# EAGLE design FTS V1.0 (EAGLE 7.5.0)
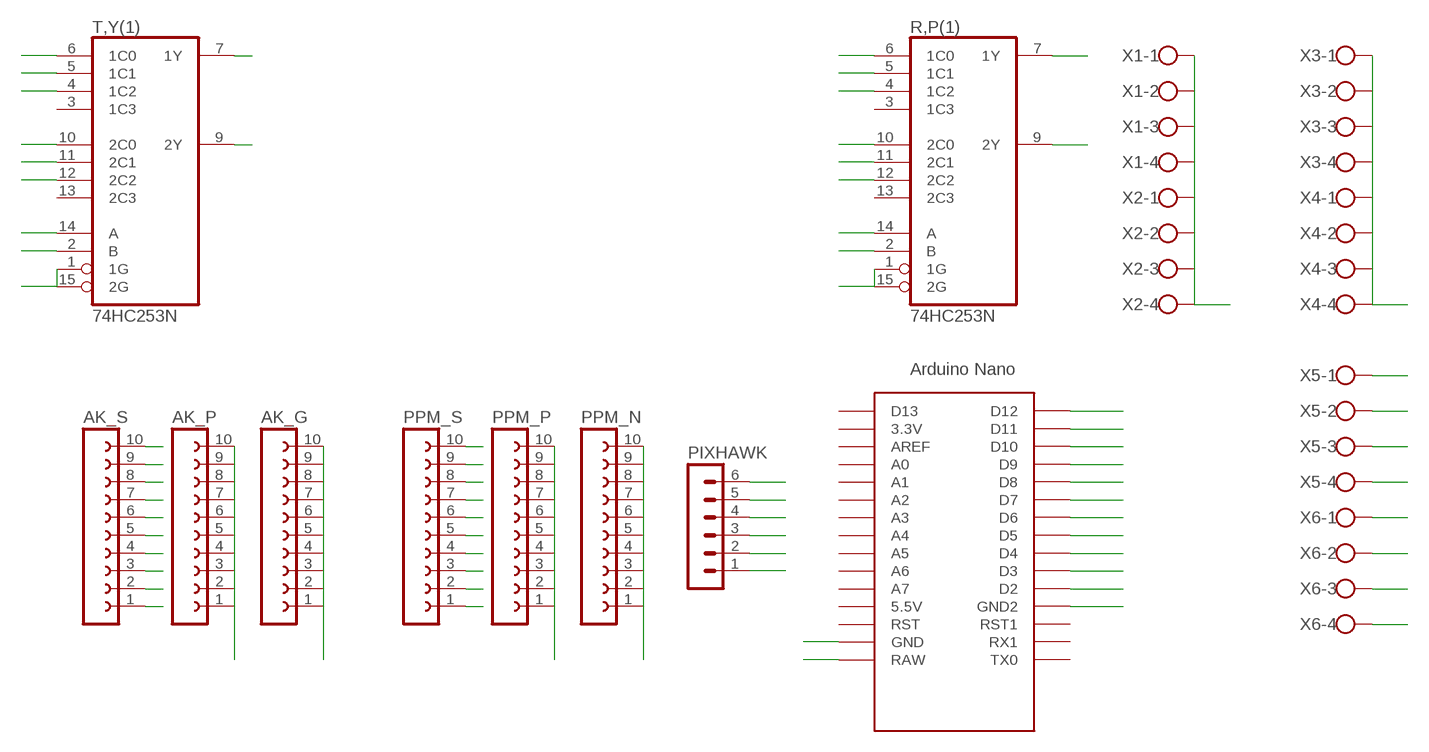
[diagram p0: schematic, sheet 1]

## Parts
AK_G  FE10-1  [FE10]
AK_P  FE10-1  [FE10]
AK_S  FE10-1  [FE10]
PIXHAWK  MA06-1  [MA06-1]
PPM_N  FE10-1  [FE10]
PPM_P  FE10-1  [FE10]
PPM_S  FE10-1  [FE10]
R,P(1)  74HC253N  [DIL16]
T,Y(1)  74HC253N  [DIL16]
U$1  NANO  [NANO]
X1  W237-4  [W237-4]
X2  W237-4  [W237-4]
X3  W237-4  [W237-4]
X4  W237-4  [W237-4]
X5  W237-4  [W237-4]
X6  W237-4  [W237-4]

## Nets
AUX2: AK_S.7 U$1.D6
DROP: AK_S.10 X6.4
FTS-P: R,P(1).12(2C2)
FTS-R: R,P(1).4(1C2)
FTS-T: T,Y(1).4(1C2)
FTS-Y: T,Y(1).12(2C2)
GBL-P: AK_S.9 X6.3
GBL-R: AK_S.8 X6.2
GEAR: AK_S.6 U$1.D5
GND: AK_G.1 AK_G.2 AK_G.3 AK_G.4 AK_G.5 AK_G.6 AK_G.7 AK_G.8 AK_G.9 AK_G.10 PIXHAWK.6 PPM_N.1 PPM_N.2 PPM_N.3 PPM_N.4 PPM_N.5 PPM_N.6 PPM_N.7 PPM_N.8 PPM_N.9 PPM_N.10 R,P(1).1(1G) R,P(1).15(2G) T,Y(1).1(1G) T,Y(1).15(2G) U$1.GND U$1.GND1(GND2) X3.1 X3.2 X3.3 X3.4 X4.1 X4.2 X4.3 X4.4
N$50: PPM_S.10
N$51: PPM_S.9
N$52: PPM_S.8
N$53: PPM_S.7
N$54: PPM_S.6
N$59: PIXHAWK.5
N$71: U$1.D11
N$72: U$1.D10
N$73: U$1.D9
N$74: U$1.D8
N$75: U$1.D7
N$78: U$1.D4
PX-P: PIXHAWK.2 R,P(1).11(2C1)
PX-R: PIXHAWK.1 R,P(1).5(1C1)
PX-T: PIXHAWK.3 T,Y(1).5(1C1)
PX-Y: PIXHAWK.4 T,Y(1).11(2C1)
RX-FM: AK_S.5 PPM_S.5
RX-P: AK_S.2 PPM_S.2 R,P(1).10(2C0)
RX-R: AK_S.1 PPM_S.1 R,P(1).6(1C0)
RX-T: AK_S.3 PPM_S.3 T,Y(1).6(1C0) U$1.D12
RX-Y: AK_S.4 PPM_S.4 T,Y(1).10(2C0)
S1: R,P(1).14(A) T,Y(1).14(A) U$1.D2
S2: R,P(1).2(B) T,Y(1).2(B) U$1.D3
S-P: R,P(1).9(2Y) X5.2
S-R: R,P(1).7(1Y) X5.1
S-T: T,Y(1).7(1Y) X5.3
S-Y: T,Y(1).9(2Y) X5.4 X6.1
VCC: AK_P.1 AK_P.2 AK_P.3 AK_P.4 AK_P.5 AK_P.6 AK_P.7 AK_P.8 AK_P.9 AK_P.10 PPM_P.1 PPM_P.2 PPM_P.3 PPM_P.4 PPM_P.5 PPM_P.6 PPM_P.7 PPM_P.8 PPM_P.9 PPM_P.10 U$1.RAW X1.1 X1.2 X1.3 X1.4 X2.1 X2.2 X2.3 X2.4
Unconnected: R,P(1).3(1C3) R,P(1).13(2C3) T,Y(1).3(1C3) T,Y(1).13(2C3) U$1.3.3V U$1.5V(5.5V) U$1.A0 U$1.A1 U$1.A2 U$1.A3 U$1.A4 U$1.A5 U$1.A6 U$1.A7 U$1.AREF U$1.D13 U$1.ICSP1 U$1.ICSP2 U$1.ICSP3 U$1.ICSP4 U$1.ICSP5 U$1.ICSP6 U$1.RST U$1.RST1 U$1.RX1 U$1.TX0

## Power pins joined to a net without a drawn wire
GND: R,P(1).8(GND) T,Y(1).8(GND)
VCC: R,P(1).16(VCC) T,Y(1).16(VCC)

## Library data of the parts
AK_G AK_P AK_S PPM_N PPM_P PPM_S = con-lsta:FE10-1: FEMALE HEADER; OC_FARNELL: unknown; OC_NEWARK: unknown
PIXHAWK = con-lstb:MA06-1: PIN HEADER; OC_FARNELL: unknown; OC_NEWARK: unknown
R,P(1) T,Y(1) = 74xx-eu:74*253: Dual 4-to 1 line data SELECTOR/MULTIPLEXER, 3-state
U$1 = Arduino-clone:NANO: Arduino Nano
X1-X6 = con-wago-500:W237-4: WAGO SCREW CLAMP; OC_FARNELL: unknown; OC_NEWARK: unknown

## Board
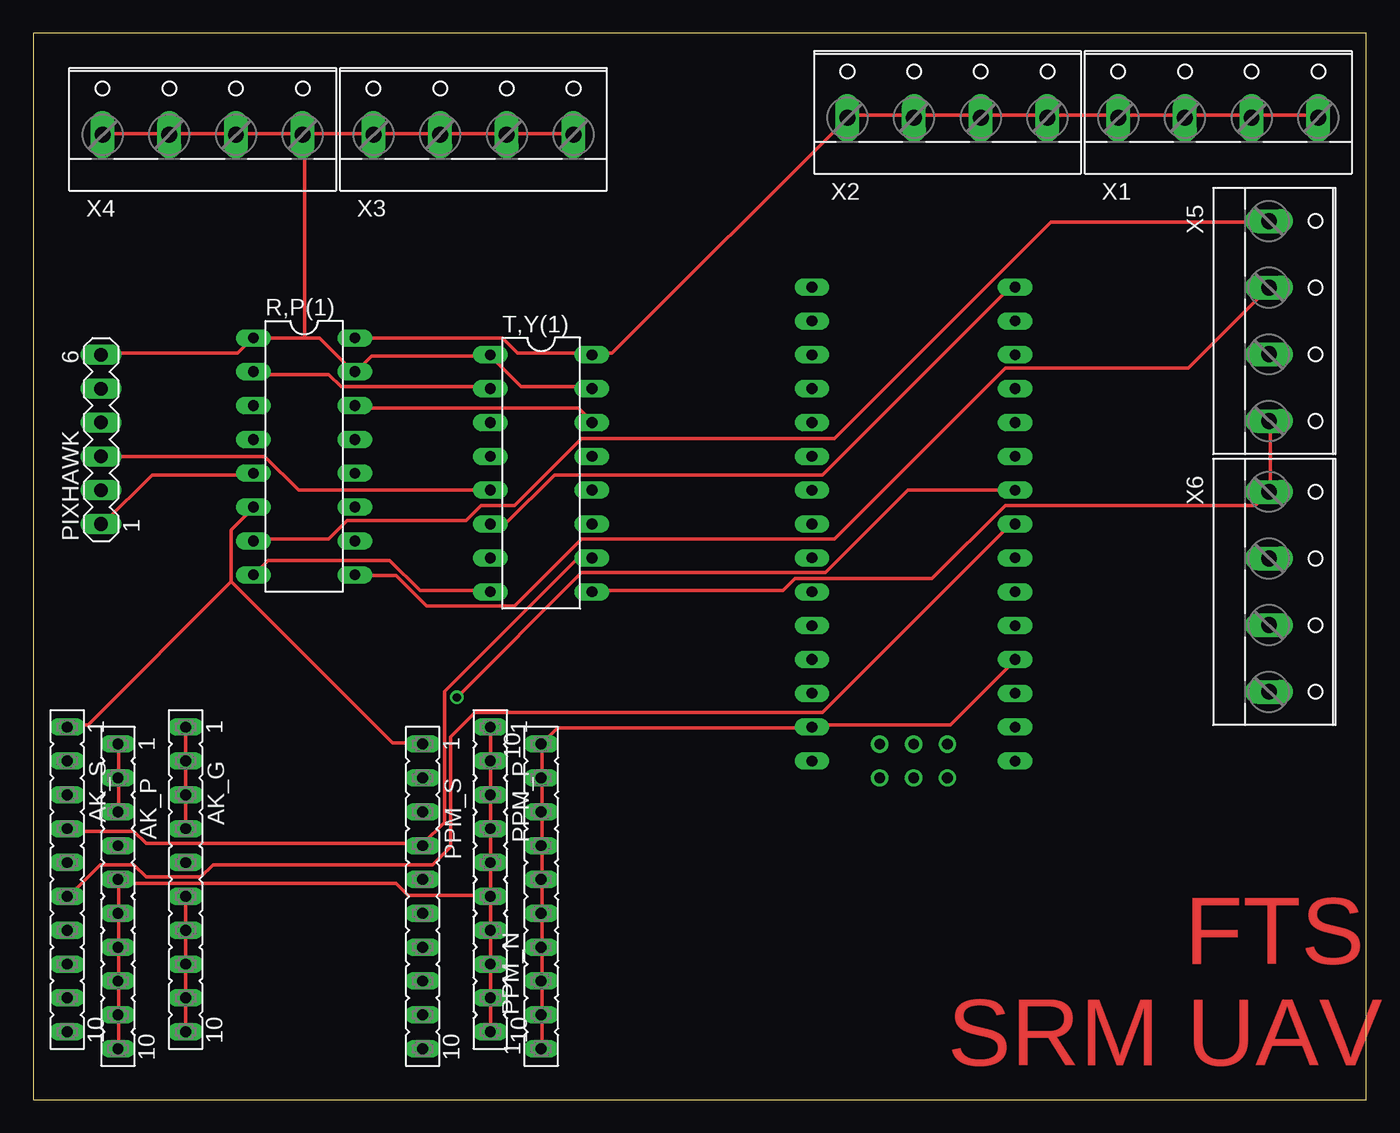
[diagram p1: board, top side]
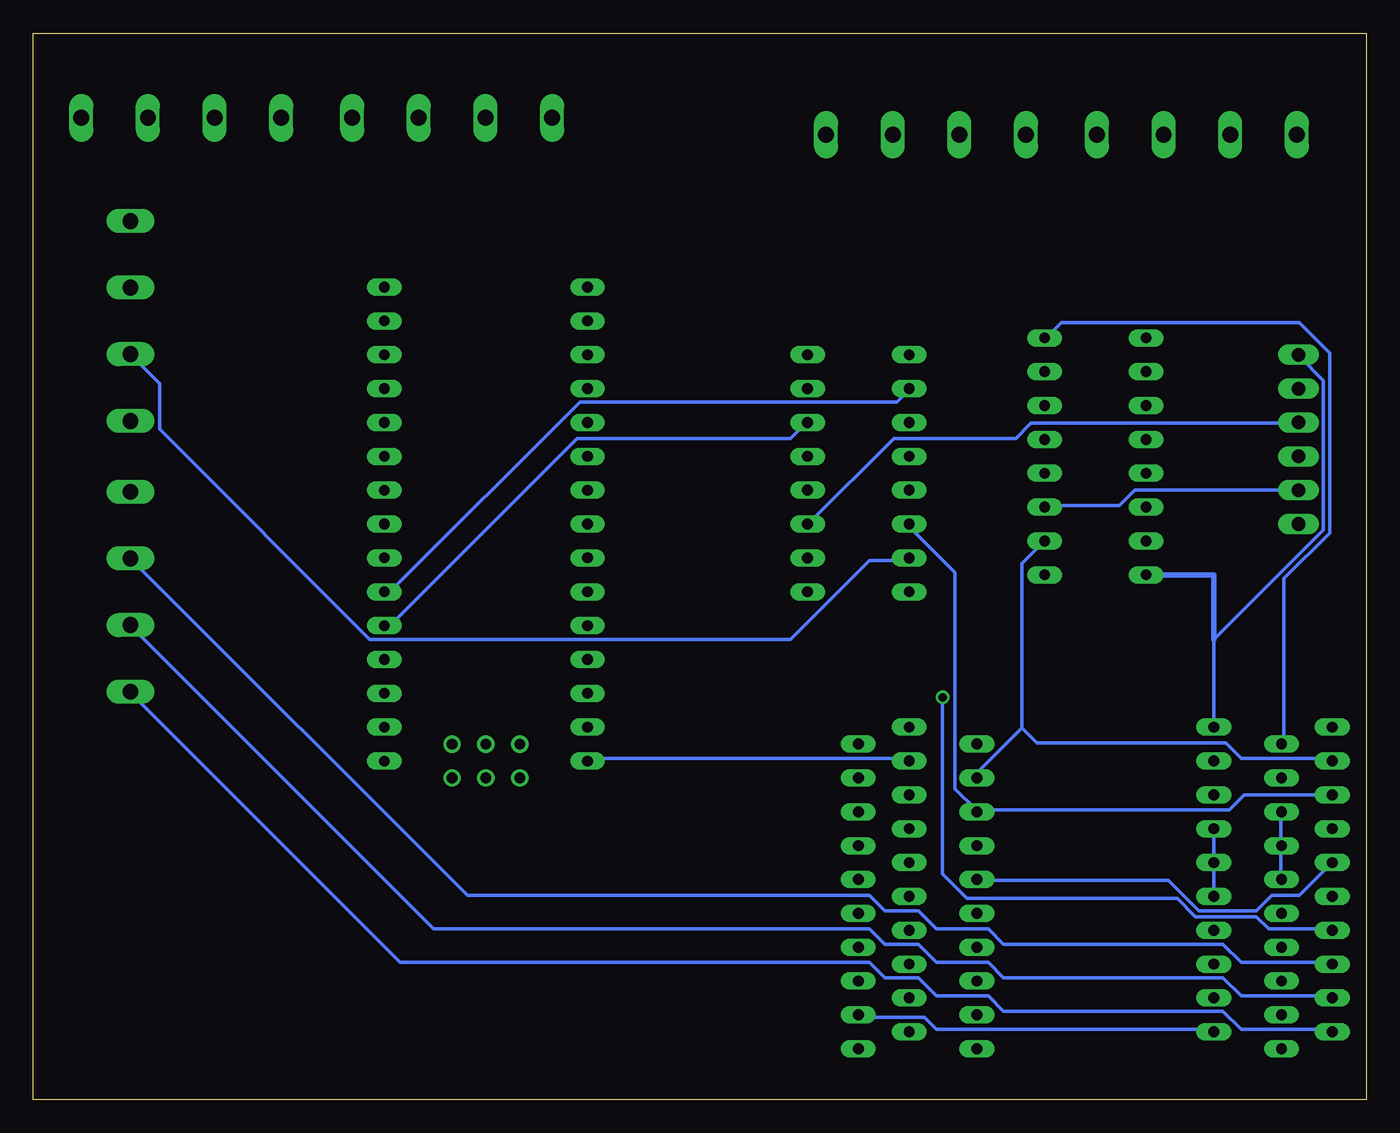
[diagram p2: board, bottom side, seen from below]

Size 100 x 80 mm. Coordinates in mm from the lower left corner, seen from the top.
Outline: 0,0 100,0 100,80 0,80 0,0
Copper layers (1*16): Top 0.035mm / dielectric 1.5mm / Bottom 0.035mm
Design rules "default": minimum track width 10mil, minimum drill 24mil, track to track 8mil, track to pad 8mil, pad to pad 8mil, via to via 8mil, smd to smd 8mil, copper to edge 40mil, drill to drill 8mil, minimum pad ring 10mil, minimum via ring 8mil, stop-mask expansion 4mil, vias tented up to drill 0mil, thermal gap 10mil

### Footprints (pad centres in the part's own frame; a part is rotated, then mirrored left to right if it is on the bottom)
FE10 = drill 0.813 long: 1 -11.43,0; 2 -8.89,0; 3 -6.35,0; 4 -3.81,0; 5 -1.27,0; 6 1.27,0; 7 3.81,0; 8 6.35,0; 9 8.89,0; 10 11.43,0
MA06-1 = drill 1.016 long: 1 -6.35,0; 2 -3.81,0; 3 -1.27,0; 4 1.27,0; 5 3.81,0; 6 6.35,0
DIL16 = drill 0.813 long: 1 -8.89,-3.81; 2 -6.35,-3.81; 3 -3.81,-3.81; 4 -1.27,-3.81; 5 1.27,-3.81; 6 3.81,-3.81; 7 6.35,-3.81; 8 8.89,-3.81; 9 8.89,3.81; 10 6.35,3.81; 11 3.81,3.81; 12 1.27,3.81; 13 -1.27,3.81; 14 -3.81,3.81; 15 -6.35,3.81; 16 -8.89,3.81
NANO = drill 0.8 long: 3.3V -10.16,24.13; 5V -10.16,-1.27; A0 -10.16,19.05; A1 -10.16,16.51; A2 -10.16,13.97; A3 -10.16,11.43; A4 -10.16,8.89; A5 -10.16,6.35; A6 -10.16,3.81; A7 -10.16,1.27; AREF -10.16,21.59; D2 5.08,1.27; D3 5.08,3.81; D4 5.08,6.35; D5 5.08,8.89; D6 5.08,11.43; D7 5.08,13.97; D8 5.08,16.51; D9 5.08,19.05; D10 5.08,21.59; D11 5.08,24.13; D12 5.08,26.67; D13 -10.16,26.67; GND -10.16,-6.35; GND1 5.08,-1.27; RAW -10.16,-8.89; RST -10.16,-3.81; RST1 5.08,-3.81; RX1 5.08,-6.35; TX0 5.08,-8.89 | drill 0.8: ICSP1 -5.08,-10.16; ICSP2 -5.08,-7.62; ICSP3 -2.54,-10.16; ICSP4 -2.54,-7.62; ICSP5 0,-10.16; ICSP6 0,-7.62
W237-4 = drill 1.194 long: 1 -7.5,-1.27; 2 -2.5,-1.27; 3 2.5,-1.27; 4 7.5,-1.27

### Placement (x,y rotation side)
AK_G  11.43,16.51 270 top
AK_P  6.35,15.24 270 top
AK_S  2.54,16.51 270 top
PIXHAWK  5.08,49.53 90 top
PPM_N  38.1,15.24 90 top
PPM_P  34.29,16.51 270 top
PPM_S  29.21,15.24 270 top
R,P(1)  20.32,48.26 270 top
T,Y(1)  38.1,46.99 270 top
U$1  68.58,34.29 0 top
X1  88.9,74.93 0 top
X2  68.58,74.93 0 top
X3  33.02,73.66 0 top
X4  12.7,73.66 0 top
X5  93.98,58.42 270 top
X6  93.98,38.1 270 top

### Tracks (layer width: path | path; a pad name or v marks a point on that pad's centre or on a via)
AUX2  (via drill 0.61)
  Top 0.254: U$1.D6 65.61,45.72 59.44,39.55 41.15,39.55 v31.77,30.18
  Bottom 0.254: v31.77,30.18 31.77,16.92 29.95,15.09 14.17,15.09 12.8,13.72 8.23,13.72 7.32,12.8 2.74,12.8 AK_S.7
DROP
  Bottom 0.254: AK_S.10 2.74,5.26 9.37,5.26 10.74,6.63 27.2,6.63 28.35,7.77 32.23,7.77 33.6,9.14 36.12,9.14 37.26,10.29 72.47,10.29 92.58,30.4 X6.4
GBL-P
  Bottom 0.254: AK_S.9 2.74,7.77 9.37,7.77 10.74,9.14 27.2,9.14 28.35,10.29 32.23,10.29 33.6,11.66 36.12,11.66 37.26,12.8 69.95,12.8 92.58,35.43 X6.3
GBL-R
  Bottom 0.254: AK_S.8 2.74,10.29 9.37,10.29 10.74,11.66 27.2,11.66 28.35,12.8 32.23,12.8 33.6,14.17 36.12,14.17 37.26,15.32 67.44,15.32 92.58,40.46 X6.2
GEAR
  Top 0.254: U$1.D5 73.61,42.98 73.15,42.98 59.21,29.03 33.15,29.03 31.32,27.2 31.32,18.97 29.95,17.6 13.49,17.6 12.57,16.69 8.46,16.69 7.54,17.6 5.03,17.6 2.74,15.32 AK_S.6
GND
  Top 0.254: R,P(1).8 17.6,40.46 26.75,40.46 29.03,38.18 34.29,38.18 T,Y(1).8 | X4.1 5.26,72.47 10.06,72.47 X4.2 10.29,72.47 15.09,72.47 X4.3 15.32,72.47 20.12,72.47 X4.4 | X3.4 40.46,72.47 35.66,72.47 X3.3 35.43,72.47 30.63,72.47 X3.2 30.4,72.47 25.6,72.47 X3.1 25.38,72.47 20.34,72.47 X4.4 | 34.29,55.78 36.58,53.49 41.83,53.49 T,Y(1).15 | 20.34,57.15 21.49,57.15 24,54.63 R,P(1).15 24.23,54.63 25.38,55.78 34.29,55.78 | 20.34,57.15 R,P(1).1 16.46,57.15 15.32,56.01 5.26,56.01 PIXHAWK.6 | 34.29,55.78 T,Y(1).1 | 20.34,57.15 20.34,72.24 X4.4 | AK_G.1 AK_G.2 AK_G.3 AK_G.4 | AK_G.10 AK_G.9 AK_G.8 AK_G.7 AK_G.6 | U$1.GND1 73.61,32.92 68.81,28.12 58.52,28.12 U$1.GND 58.29,27.89 39.32,27.89 PPM_N.10 38.18,26.52 38.18,24.23 PPM_N.9 38.18,24 38.18,21.72 PPM_N.8 38.18,21.49 38.18,19.2 PPM_N.7 38.18,18.97 38.18,16.69 PPM_N.6 38.18,16.46 38.18,14.17 PPM_N.5 38.18,13.95 38.18,11.43 | PPM_N.1 38.18,3.89 38.18,6.17 PPM_N.2 38.18,6.4 38.18,8.69 PPM_N.3 38.18,8.91 38.18,11.43 | 38.18,11.43 PPM_N.4
  Bottom 0.254: AK_G.6 AK_G.5 AK_G.4 | AK_G.10 11.43,5.26 32.23,5.26 33.15,6.17 37.95,6.17 PPM_N.2 | AK_G.1 11.43,34.52 3.2,42.75 3.2,53.95 5.03,55.78 PIXHAWK.6
  Bottom 0.406: R,P(1).8 11.43,39.37 11.43,34.52
PX-P
  Bottom 0.254: PIXHAWK.2 17.37,45.72 18.52,44.58 24,44.58 R,P(1).11
PX-R
  Top 0.254: R,P(1).5 16.46,46.86 8.91,46.86 5.26,43.2 PIXHAWK.1
PX-T
  Top 0.254: T,Y(1).5 19.89,45.72 17.37,48.23 5.26,48.23 PIXHAWK.3
PX-Y
  Bottom 0.254: T,Y(1).11 41.83,43.2 35.43,49.61 26.29,49.61 25.15,50.75 5.26,50.75 PIXHAWK.4
RX-FM
  Bottom 0.254: PPM_S.5 29.03,16.46 14.86,16.46 12.57,14.17 8.23,14.17 7.09,15.32 5.03,15.32 2.74,17.6 AK_S.5
RX-P
  Bottom 0.254: 25.83,27.89 29.03,24.69 29.03,24.23 PPM_S.2 | 25.83,27.89 25.83,40.23 24.23,41.83 R,P(1).10 | 25.83,27.89 24.69,26.75 10.52,26.75 9.37,25.6 2.74,25.6 AK_S.2
RX-R
  Top 0.254: 14.86,38.86 26.98,26.75 29.03,26.75 PPM_S.1 | 14.86,38.86 14.86,42.75 16.46,44.35 R,P(1).6 | 14.86,38.86 4.12,28.12 2.74,28.12 AK_S.1
RX-T
  Top 0.254: U$1.D12 73.61,60.81 73.15,60.81 59.21,46.86 39.09,46.86 35.43,43.2 34.29,43.2 T,Y(1).6
  Bottom 0.254: T,Y(1).6 34.29,42.98 30.86,39.55 30.86,23.32 29.26,21.72 PPM_S.3 29.03,21.72 10.29,21.72 9.14,22.86 AK_S.3
RX-Y
  Top 0.254: AK_S.4 2.74,20.12 7.54,20.12 8.46,19.2 29.03,19.2 PPM_S.4 29.26,19.2 30.86,20.8 30.86,30.63 40.69,40.46 41.83,40.46 T,Y(1).10
S1
  Top 0.254: R,P(1).14 24.23,51.89 40.92,51.89 41.83,50.98 T,Y(1).14
  Bottom 0.254: U$1.D2 73.61,35.66 73.15,35.66 59.21,49.61 43.2,49.61 42.06,50.75 T,Y(1).14
S2
  Top 0.254: R,P(1).2 16.69,54.41 22.17,54.41 23.09,53.49 34.29,53.49 T,Y(1).2
  Bottom 0.254: U$1.D3 73.61,38.18 73.15,38.18 58.98,52.35 35.2,52.35 34.29,53.26 T,Y(1).2
S-P
  Top 0.254: R,P(1).9 24.23,39.32 27.2,39.32 29.49,37.03 36.12,37.03 41.15,42.06 60.12,42.06 72.92,54.86 86.64,54.86 92.58,60.81 X5.2
S-R
  Top 0.254: R,P(1).7 16.69,42.06 22.17,42.06 23.55,43.43 32.46,43.43 33.6,44.58 36.12,44.58 41.15,49.61 60.12,49.61 76.35,65.84 92.58,65.84 X5.1
S-T
  Bottom 0.254: T,Y(1).7 34.29,40.46 37.26,40.46 43.2,34.52 74.75,34.52 90.53,50.29 90.53,53.72 92.58,55.78 X5.3
S-Y
  Top 0.254: T,Y(1).9 42.06,38.18 56.24,38.18 57.15,39.09 67.44,39.09 72.92,44.58 91.67,44.58 92.58,45.49 X6.1 92.81,45.72 92.81,50.75 X5.4
VCC
  Top 0.254: AK_P.3 6.4,21.72 6.4,24 AK_P.2 6.4,24.23 6.4,26.52 AK_P.1 | AK_P.10 6.4,3.89 6.4,6.17 AK_P.9 6.4,6.4 6.4,8.69 AK_P.8 6.4,8.91 6.4,11.43 | 6.4,11.43 6.4,13.95 AK_P.6 6.4,14.17 6.4,16.23 | 6.4,16.23 6.4,16.46 AK_P.5 6.4,16.23 | 6.4,11.43 AK_P.7 | 34.29,15.32 PPM_P.5 PPM_P.4 PPM_P.3 PPM_P.2 PPM_P.1 | PPM_P.10 PPM_P.9 PPM_P.8 PPM_P.7 PPM_P.6 34.29,15.32 | 6.4,16.23 27.2,16.23 28.12,15.32 34.29,15.32 | R,P(1).16 35.2,57.15 36.35,56.01 41.83,56.01 T,Y(1).16 42.06,56.01 43.43,56.01 61.04,73.61 X2.1 61.27,73.84 66.06,73.84 X2.2 66.29,73.84 70.87,73.84 X2.3 71.09,73.84 75.89,73.84 X2.4 76.12,73.84 81.38,73.84 X1.1 81.61,73.84 86.18,73.84 X1.2 86.41,73.84 91.21,73.84 X1.3 91.44,73.84 96.24,73.84 X1.4
  Bottom 0.254: AK_P.5 6.4,16.69 6.4,18.97 AK_P.4 6.4,19.2 6.4,21.49 AK_P.3 | U$1.RAW 58.29,25.6 34.29,25.6 PPM_P.2 | AK_P.1 6.17,26.75 6.17,39.09 2.74,42.52 2.74,56.01 5.03,58.29 22.86,58.29 24,57.15 R,P(1).16

### Text on the board
Top: FTS | SRM UAV